# EAGLE design charging (EAGLE 7.4.0)
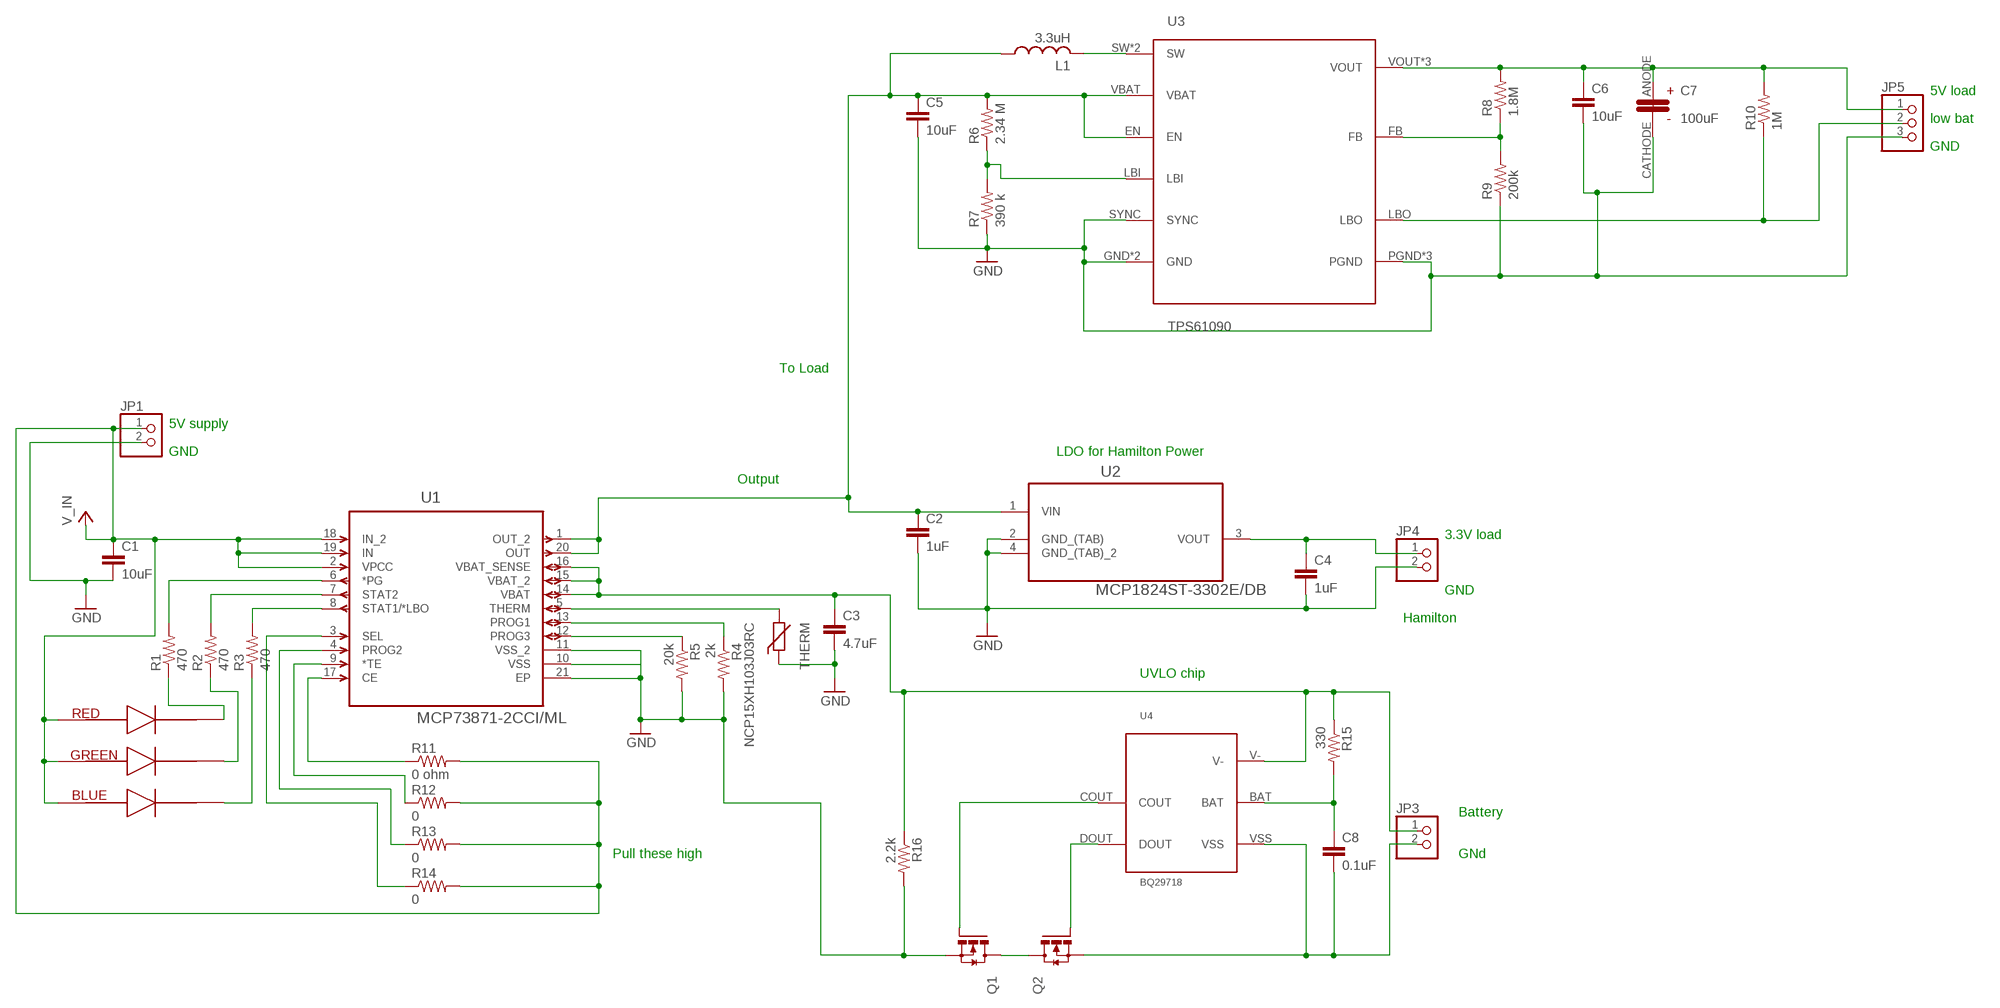
[diagram p0: schematic, sheet 1]

## Parts
C1  10uF  C-EUC0805  [C0805]
C2  1uF  C-EUC0603K  [C0603K]
C3  4.7uF  C-EUC0805  [C0805]
C4  1uF  C-EUC0603K  [C0603K]
C5  10uF  C-EUC0603K  [C0603K]
C6  10uF  C-EUC0603K  [C0603K]
C7  100uF  T491C686K010AT  [6032]
C8  0.1uF  C-EUC0805  [C0805]
JP1  PINHD-1X2  [1X02]
JP3  PINHD-1X2  [1X02]
JP4  PINHD-1X2  [1X02]
JP5  PINHD-1X3  [1X03]
L1  3.3uH  L-US  [2-SMD]
Q1  CSD16301Q2  [6-SMD]
Q2  CSD16301Q2  [6-SMD]
R1  470  R-US_R0805  [R0805]
R2  470  R-US_R0805  [R0805]
R3  470  R-US_R0805  [R0805]
R4  2k  R-US_R0805  [R0805]
R5  20k  R-US_R0805  [R0805]
R6  2.34 M  R-US_R0603  [R0603]
R7  390 k  R-US_R0603  [R0603]
R8  1.8M  R-US_R0603  [R0603]
R9  200k  R-US_R0603  [R0603]
R10  1M  R-US_R0603  [R0603]
R11  0 ohm  R-US_R0603  [R0603]
R12  0  R-US_R0603  [R0603]
R13  0  R-US_R0603  [R0603]
R14  0  R-US_R0603  [R0603]
R15  330  R-US_R0805  [R0805]
R16  2.2k  R-US_R0805  [R0805]
THERM  NCP15XH103J03RC  [CT/CN0402]
U1  MCP73871-2CCI/ML  [QFN50P400X400X100-21N]
U2  MCP1824ST-3302E/DB  [SOT230P700X180-4N]
U3  TPS61090  [QFN-16]
U4  BQ29718  [6-WFDFN]
U$1  CLP6C-FKB  [CREE_PLCC6_3-IN-1_SMD_LED_CLP6C-FKB]

## Nets
GND: C1.2 C2.2 C3.2 C4.2 C5.2 C6.2 C7.CATHODE JP1.2 JP4.2 JP5.3 Q1.S_1(S) Q1.S_2(S) R4.2 R5.2 R7.1 R9.1 R16.2 THERM.1 U1.10(VSS) U1.11(VSS_2) U1.21(EP) U2.2(GND_(TAB)) U2.4(GND_(TAB)_2) U3.GND U3.P$17(GND) U3.PGND U3.PGND_2(PGND) U3.PGND_3(PGND) U3.SYNC
N$1: R3.2 U1.8(STAT1/*LBO)
N$2: R2.2 U1.7(STAT2)
N$3: R1.2 U1.6(*PG)
N$4: R1.1 U$1.RED_CATHODE
N$5: R2.1 U$1.GREEN_CATHODE
N$6: R3.1 U$1.BLUE_CATHODE
N$7: R11.1 U1.17(CE)
N$8: R12.1 U1.9(*TE)
N$9: R13.1 U1.4(PROG2)
N$10: R14.1 U1.3(SEL)
N$11: C2.1 C5.1 L1.P$1 R6.2 U1.1(OUT_2) U1.20(OUT) U2.1(VIN) U3.EN U3.VBAT
N$13: THERM.2 U1.5(THERM)
N$14: R4.1 U1.13(PROG1)
N$15: Q2.G U4.DOUT
N$16: R5.1 U1.12(PROG3)
N$17: C4.1 JP4.1 U2.3(VOUT)
N$18: R6.1 R7.2 U3.LBI
N$19: L1.P$2 U3.SW U3.SW_2(SW)
N$20: C6.1 C7.ANODE JP5.1 R8.2 R10.2 U3.VOUT U3.VOUT_2(VOUT) U3.VOUT_3(VOUT)
N$21: R8.1 R9.2 U3.FB
N$22: Q1.G U4.COUT
N$23: JP5.2 R10.1 U3.LBO
N$24: Q1.D_1(D) Q1.D_2(D) Q1.D_3(D) Q1.D_4(D) Q1.D_5(D) Q2.D_1(D) Q2.D_2(D) Q2.D_3(D) Q2.D_4(D) Q2.D_5(D)
N$25: C8.2 JP3.2 Q2.S_1(S) Q2.S_2(S) U4.VSS
N$27: C3.1 JP3.1 R15.1 R16.1 U1.14(VBAT) U1.15(VBAT_2) U1.16(VBAT_SENSE) U4.V-
N$29: C8.1 R15.2 U4.BAT
VCC: C1.1 JP1.1 R11.2 R12.2 R13.2 R14.2 U1.2(VPCC) U1.18(IN_2) U1.19(IN) U$1.BLUE_ANODE U$1.GREEN_ANODE U$1.RED_ANODE ; supply symbol labelled V_IN

## Notes on the sheet
- 5V load
- low bat
- GND
- To Load
- 5V supply
- GND | LDO for Hamilton Power
- Output
- 3.3V load
- GND
- Hamilton
- UVLO chip
- Battery
- Pull these high | GNd

## Library data of the parts
C1-C6 C8 = resistor:C-EU: CAPACITOR, European symbol
C7 = insole:T491C686K010AT
JP1 JP3 JP4 = pinhead:PINHD-1X2: PIN HEADER
JP5 = pinhead:PINHD-1X3: PIN HEADER
L1 = insole:L-US: INDUCTOR, American symbol
Q1 Q2 = insole:CSD16301Q2
R1-R16 = resistor:R-US_: RESISTOR, American symbol
THERM = varistor:NCP15XH103J03RC
U1 = Microchip_By_element14_Batch_1:MCP73871-2CCI/ML: IC, BATTERY CHARGER, 1A; MPN: MCP73871-2CCI/ML; OC_FARNELL: 1642489; OC_NEWARK: 54M4957; PACKAGE: QFN-20; SUPPLIER: Microchip
U2 = Microchip_By_element14_Batch_1:MCP1824ST-3302E/DB: IC, LDO VOLT REG, 3.3V, 0.3A,; MPN: MCP1824ST-3302E/DB; OC_FARNELL: 1578379; OC_NEWARK: 05N1293; PACKAGE: SOT-223-3; SUPPLIER: Microchip
U3 = insole:TPS61090
U4 = insole:BQ29718
U$1 = insole:CLP6C-FKB

## Board
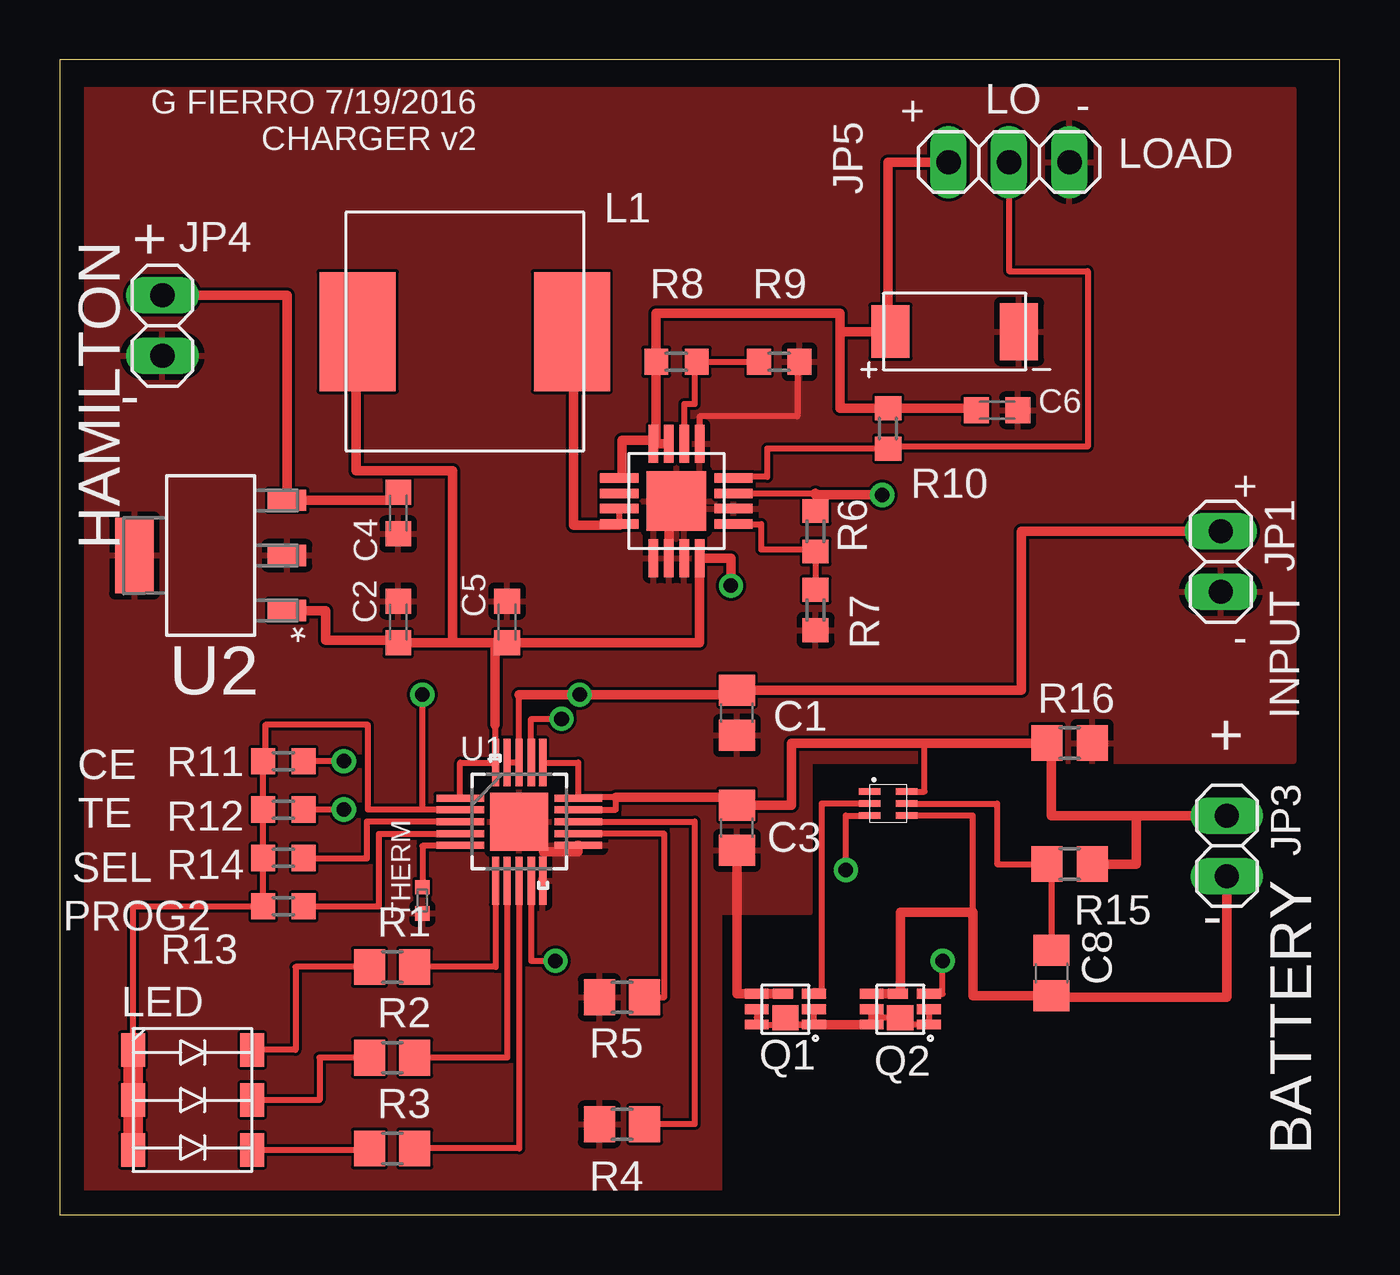
[diagram p1: board, top side]
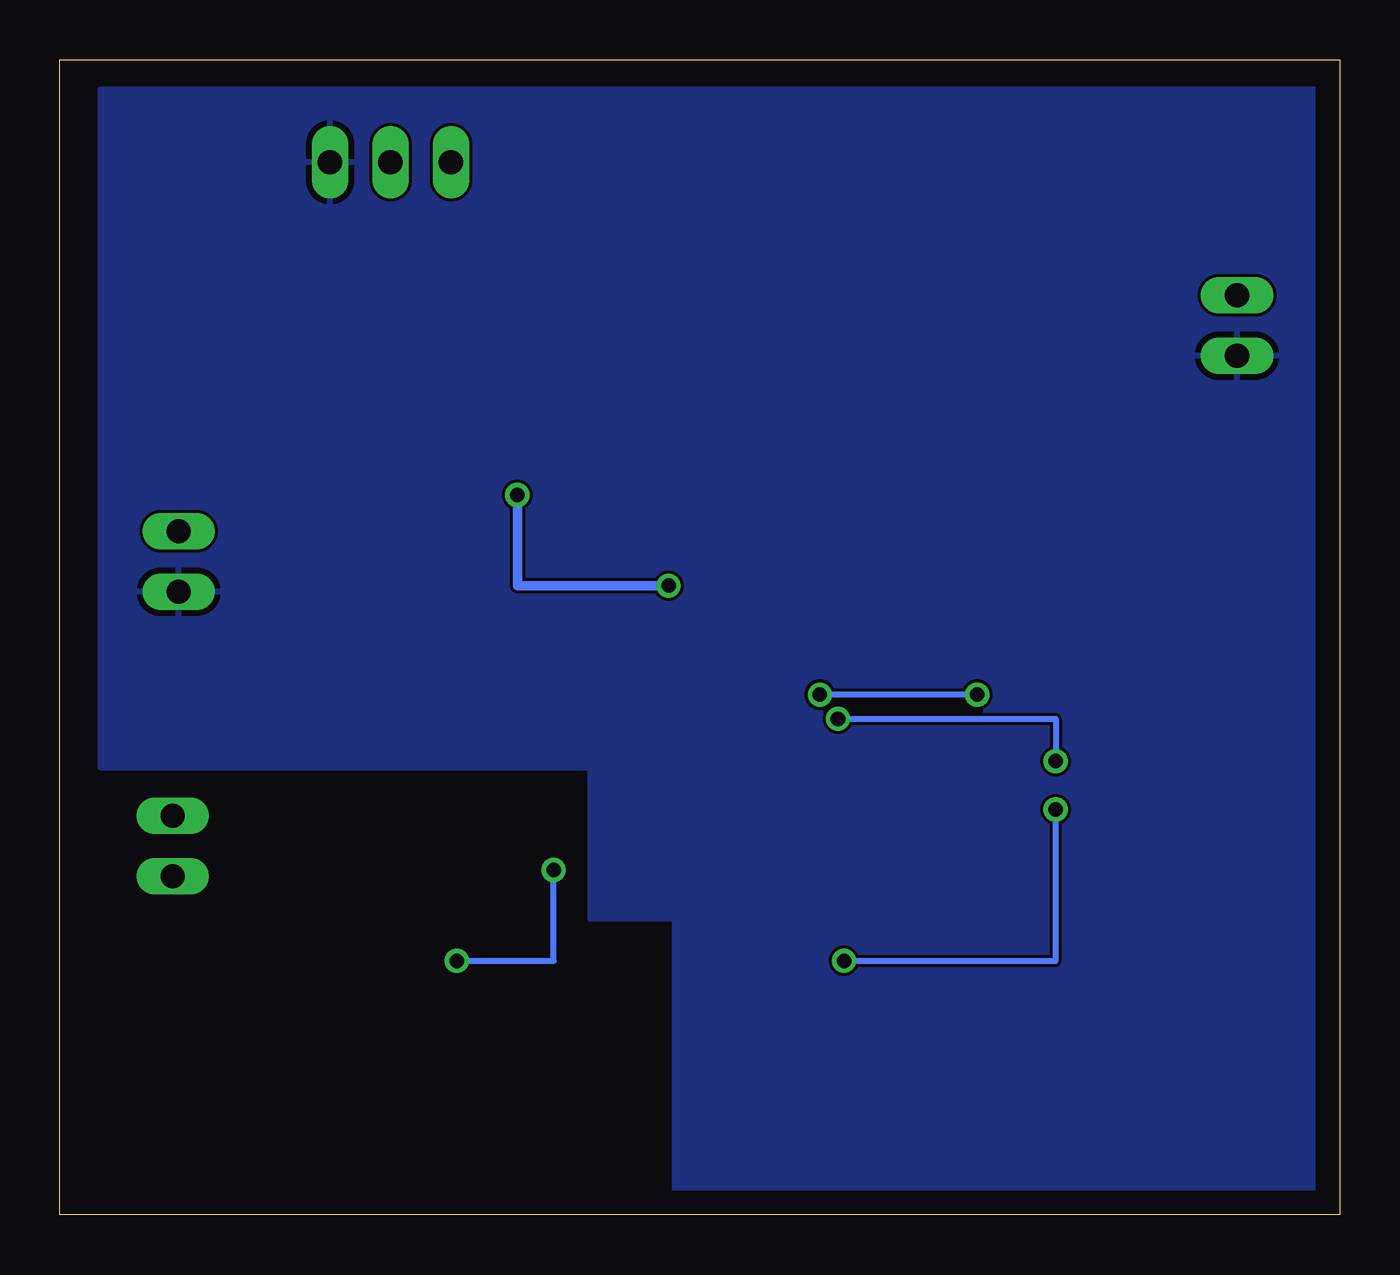
[diagram p2: board, bottom side, seen from below]

Size 53.77 x 48.5 mm. Coordinates in mm from the lower left corner, seen from the top.
Outline: 0,0 53.77,0 53.77,48.5 0,48.5 0,0
Copper layers (1*16): Top 0.035mm / dielectric 1.5mm / Bottom 0.035mm
Design rules "default *": minimum track width 10mil, minimum drill 24mil, track to track 5mil, track to pad 5mil, pad to pad 5mil, via to via 5mil, smd to smd 5mil, copper to edge 40mil, drill to drill 8mil, minimum pad ring 10mil, minimum via ring 8mil, stop-mask expansion 4mil, vias tented up to drill 0mil, thermal gap 10mil

### Footprints (pad centres in the part's own frame; a part is rotated, then mirrored left to right if it is on the bottom)
C0805 = smd 1.3 x 1.5: 1 -0.95,0; 2 0.95,0
C0603K = smd 1.05 x 1.08: 1 -0.875,0; 2 0.875,0
6032 = smd 1.6 x 2.2: ANODE 2.7,0 | smd 1.6 x 2.4: CATHODE -2.7,0
1X02 = drill 1.016 long: 1 -1.27,0; 2 1.27,0
1X03 = drill 1.016 long: 1 -2.54,0; 2 0,0; 3 2.54,0
2-SMD = smd 3.2 x 5: P$1 -4.5,0; P$2 4.5,0
6-SMD = smd 0.4 x 1: D_1 -0.65,-1.2; D_2 0,-1.2; D_3 0,1.2; D_4 -0.65,1.2; G 0.65,-1.2; S_1 0.65,1.2 | smd 1.05 x 1.1: D_5 -0.35,0 | smd 0.4 x 0.85: S_2 0.65,0.1
R0805 = smd 1.3 x 1.5: 1 -0.95,0; 2 0.95,0
R0603 = smd 1 x 1.1: 1 -0.85,0; 2 0.85,0
CT/CN0402 = smd 0.6 x 0.6: 1 -0.55,0; 2 0.55,0
QFN50P400X400X100-21N = smd 2 x 0.3: 1 -2.48,0.991; 2 -2.48,0.508; 3 -2.48,0; 4 -2.48,-0.508; 5 -2.48,-0.991; 11 2.48,-0.991; 12 2.48,-0.508; 13 2.48,0; 14 2.48,0.508; 15 2.48,0.991 | smd 0.3 x 2: 6 -0.991,-2.48; 7 -0.508,-2.48; 8 0,-2.48; 9 0.508,-2.48; 10 0.991,-2.48; 16 0.991,2.48; 17 0.508,2.48; 18 0,2.48; 19 -0.508,2.48; 20 -0.991,2.48 | smd 2.443 x 2.443: 21 0,0
SOT230P700X180-4N = smd 1.626 x 0.889: 1 -3.2,2.311; 2 -3.2,0; 3 -3.2,-2.311 | smd 1.626 x 3.175: 4 3.2,0
QFN-16 = smd 1.6 x 0.4: EN 2.4,0.32; LBI 2.4,-0.97; LBO 2.4,0.97; NC -2.4,0.32; SW -2.4,-0.97; SW_2 -2.4,-0.32; SYNC 2.4,-0.32; VOUT_3 -2.4,0.97 | smd 0.4 x 1.6: FB 0.32,2.4; GND 0.97,2.4; PGND 0.32,-2.4; PGND_2 -0.32,-2.4; PGND_3 -0.97,-2.4; VBAT 0.97,-2.4; VOUT -0.97,2.4; VOUT_2 -0.32,2.4 | smd 2.5 x 2.5: P$17 0,0
6-WFDFN = smd 0.9 x 0.28: BAT 0.78,0; COUT -0.78,0; DOUT -0.78,-0.5; NC -0.78,0.5; V- 0.78,0.5; VSS 0.78,-0.5
CREE_PLCC6_3-IN-1_SMD_LED_CLP6C-FKB = smd 1 x 1.4: BLUE_ANODE -2.5,-2.1; BLUE_CATHODE 2.5,-2.1; GREEN_ANODE -2.5,0; GREEN_CATHODE 2.5,0; RED_ANODE -2.5,2.1; RED_CATHODE 2.5,2.1

### Placement (x,y rotation side)
C1  28.45,21.08 270 top
C2  14.22,24.89 90 top
C3  28.45,16.26 270 top
C4  14.22,29.46 270 top
C5  18.8,24.89 90 top
C6  39.37,33.78 0 top
C7  37.59,37.08 180 top
C8  41.66,10.16 270 top
JP1  48.77,27.43 270 top
JP3  49.02,15.49 270 top
JP4  4.32,37.34 270 top
JP5  39.88,44.2 0 top
L1  17.02,37.08 0 top
Q1  30.48,8.64 90 top
Q2  35.31,8.64 90 top
R1  13.97,10.41 0 top
R2  13.97,6.6 0 top
R3  13.97,2.79 0 top
R4  23.62,3.81 180 top
R5  23.62,9.14 180 top
R6  31.75,28.7 90 top
R7  31.75,25.4 90 top
R8  25.91,35.81 180 top
R9  30.23,35.81 180 top
R10  34.8,33.02 90 top
R11  9.4,19.05 180 top
R12  9.4,17.02 180 top
R13  9.4,12.95 180 top
R14  9.4,14.99 180 top
R15  42.42,14.73 180 top
R16  42.42,19.81 0 top
THERM  15.24,13.21 90 top
U1  19.3,16.51 0 top
U2  6.35,27.69 180 top
U3  25.91,29.97 0 top
U4  34.8,17.27 0 top
U$1  5.59,4.83 0 top

### Tracks (layer width: path | path; a pad name or v marks a point on that pad's centre or on a via)
GND
  Top 0.254: R9.1 30.99,35.81 30.99,33.53 26.88,33.53 U3.GND
  Top 0.406: C3.2 28.45,9.29 Q1.S_1 Q1.S_2 | U3.P$17 25.59,29.97 U3.PGND_2 | U1.21 20.32,16.51 20.32,15.24 21.78,15.24 U1.11
  pour Top: -1.02,47.24 51.82,47.24 51.82,19.05 31.5,19.05 31.5,12.7 27.69,12.7 27.69,11.43 27.69,-1.02 -1.02,-1.02 -1.02,46.99
  pour Bottom: -1.02,47.24 52.07,47.24 52.07,18.8 31.5,18.8 31.5,12.45 27.94,12.45 27.94,-1.52 -1.02,-1.52
N$1
  Top 0.254: U1.8 19.3,2.79 R3.2
N$2
  Top 0.254: U1.7 18.8,6.6 R2.2
N$3
  Top 0.254: U1.6 18.31,10.41 R1.2
N$4
  Top 0.254: R1.1 9.91,10.41 9.91,6.93 U$1.RED_CATHODE
N$5
  Top 0.254: R2.1 10.92,6.6 10.92,4.83 U$1.GREEN_CATHODE
N$6
  Top 0.254: R3.1 13.02,2.73 U$1.BLUE_CATHODE
N$7  (via drill 0.61)
  Top 0.254: U1.17 19.81,20.83 v21.08,20.83 | v11.94,19.05 R11.1
  Bottom 0.254: v21.08,20.83 11.94,20.83 v11.94,19.05
N$8  (via drill 0.61)
  Top 0.254: U1.9 19.81,10.67 v20.83,10.67 | v11.94,17.02 R12.1
  Bottom 0.254: v20.83,10.67 11.94,10.67 v11.94,17.02
N$9
  Top 0.254: R13.1 13.41,12.95 13.41,16 U1.4
N$10
  Top 0.254: U1.3 12.9,16.51 12.9,14.96 10.25,14.96 R14.1
N$11  (via drill 0.61)
  Top 0.254: U1.1 16.82,18.99 U1.20 18.31,20.57 18.29,20.57 | U3.EN 31.75,30.29 R6.2
  Top 0.406: 18.29,20.57 18.29,24.02 C5.1 | C5.1 16.51,24.02 | 16.51,24.02 C2.1 14.22,24.13 11.18,24.13 11.18,25.38 U2.1 | C5.1 26.88,24.02 U3.VBAT 28.19,27.57 v28.19,26.42 | L1.P$1 12.45,37.08 12.45,31.24 16.51,31.24 16.51,24.02 | v34.54,30.23 31.75,30.23 31.75,30.29
  Bottom 0.406: v28.19,26.42 34.54,26.42 v34.54,30.23
N$13
  Top 0.254: U1.5 16.82,15.49 15.24,15.49 THERM.2
N$14
  Top 0.254: U1.13 26.67,16.51 26.67,3.81 R4.1
N$15  (via drill 0.61)
  Top 0.254: v33.02,14.48 33.02,16.76 U4.DOUT | Q2.G 37.08,9.29 v37.08,10.67
  Bottom 0.254: v33.02,14.48 33.02,10.67 v37.08,10.67
N$16
  Top 0.254: R5.1 25.4,9.14 25.4,16 U1.12
N$17
  Top 0.406: C4.1 14.22,30 U2.3 9.55,38.61 JP4.1
N$18
  Top 0.254: U3.LBI 29.46,29 29.46,27.94 31.75,27.94 R6.1 R7.2
N$19
  Top 0.254: U3.SW U3.SW_2
  Top 0.406: L1.P$2 21.59,37.08 21.59,28.96 23.51,28.96 U3.SW
N$20
  Top 0.406: U3.VOUT_3 23.62,30.94 23.62,32.51 24.94,32.51 | 24.94,32.51 U3.VOUT U3.VOUT_2 | 24.94,32.51 25.06,32.51 R8.2 25.06,37.85 32.77,37.85 32.77,37.08 | 32.77,37.08 32.77,33.87 R10.2 38.49,33.87 C6.1 | 32.77,37.08 C7.ANODE 34.8,37.08 34.8,44.2 JP5.1
N$21
  Top 0.254: U3.FB 26.23,34.04 26.67,34.04 26.67,35.81 R8.1 R9.2
N$22
  Top 0.254: U4.COUT 32,17.27 32,9.4 31.68,9.4 Q1.G
N$23
  Top 0.254: JP5.2 39.88,39.62 43.18,39.62 43.18,32.26 34.8,32.26 R10.1 29.72,32.17 29.72,30.99 28.31,30.99 U3.LBO
N$24
  Top 0.254: Q2.D_2 Q2.D_1 35.31,7.99 Q2.D_5 34.11,8.29 Q2.D_4 Q2.D_3 | Q1.D_1 Q1.D_2 | 29.28,8.29 Q1.D_4 | Q1.D_3 Q1.D_4 | Q1.D_4 Q1.D_1 | Q1.D_1 30.48,7.99 Q1.D_5
  Top 0.406: Q2.D_4 Q1.D_1
N$25
  Top 0.254: 38.35,12.7 38.35,16.76 U4.VSS
  Top 0.406: Q2.S_1 Q2.S_2 35.31,9.29 35.31,12.7 38.35,12.7 38.35,9.21 C8.2 41.66,9.14 49.02,9.14 JP3.2
N$27
  Top 0.254: U4.V- 36.32,17.77 36.32,19.81 | U1.14 23.37,17.02 23.37,17.53 21.78,17.53 U1.15 21.78,18.99 U1.16
  Top 0.406: 45.21,16.76 41.66,16.76 41.66,19.81 R16.1 36.32,19.81 30.73,19.81 30.73,17.21 C3.1 28.45,17.53 23.37,17.53 | 45.21,16.76 JP3.1 | R15.1 45.21,14.73 45.21,16.76
N$29
  Top 0.254: U4.BAT 39.37,17.27 39.37,14.73 R15.2 41.66,14.73 C8.1
VCC  (via drill 0.61)
  Top 0.254: U$1.RED_ANODE 3.09,12.95 R13.2 R14.2 R12.2 R11.2 8.64,19.05 8.64,20.57 12.95,20.57 12.95,17.02 U1.2 15.24,17.02 v15.24,21.84 | U1.19 U1.18 19.3,21.84
  Top 0.406: JP1.1 40.39,28.7 40.39,22.03 C1.1 28.45,21.84 v21.84,21.84 19.3,21.84
  Top 0.813: U$1.RED_ANODE U$1.GREEN_ANODE U$1.BLUE_ANODE
  Bottom 0.254: v15.24,21.84 v21.84,21.84

### Text on the board
tNames: G FIERRO 7/19/2016 / CHARGER v2 | + | LO | - | LOAD | + | - | + | HAMILTON | - | INPUT | + | CE | TE | SEL | PROG2 | - | BATTERY